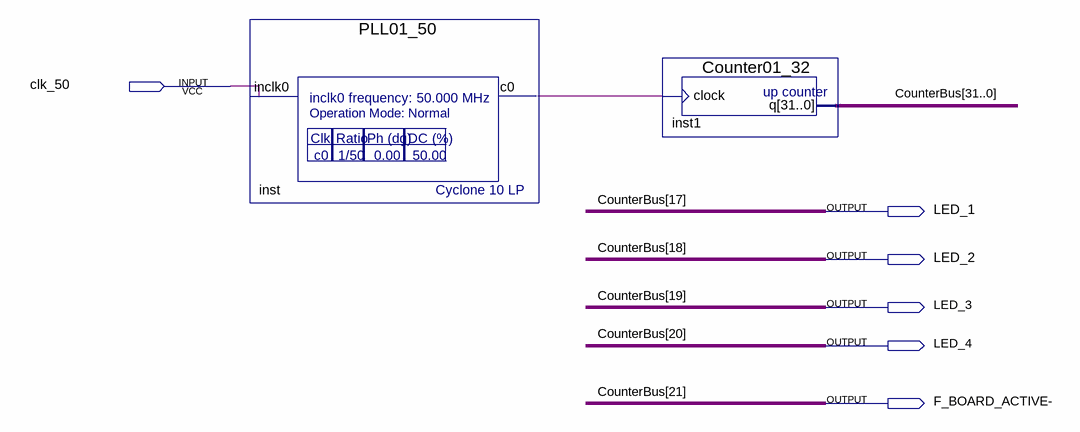
[diagram p0: schematic sheet]
// Quartus schematic Z80_FPGA0 -- (LED's TEST).bdf as structural Verilog: 2 symbols, 6 pins
module \Z80_FPGA0_--_(LED's_TEST)  (
  input  clk_50,
  output LED_1,
  output LED_2,
  output LED_3,
  output LED_4,
  output \F_BOARD_ACTIVE- 
);

  wire inst_c0;
  wire [31:0] CounterBus;

  PLL01_50 inst (.inclk0(clk_50), .c0(inst_c0));
  Counter01_32 inst1 (
    .clock(inst_c0), .q({CounterBus[31:22], \F_BOARD_ACTIVE- , LED_4, LED_3, LED_2, LED_1, CounterBus[16:0]}));

  // Other names for the same wires on the sheet: CounterBus[21:17] = {\F_BOARD_ACTIVE- , LED_4, LED_3, LED_2, LED_1}
endmodule
